# Altium project BTL.PrjPcb
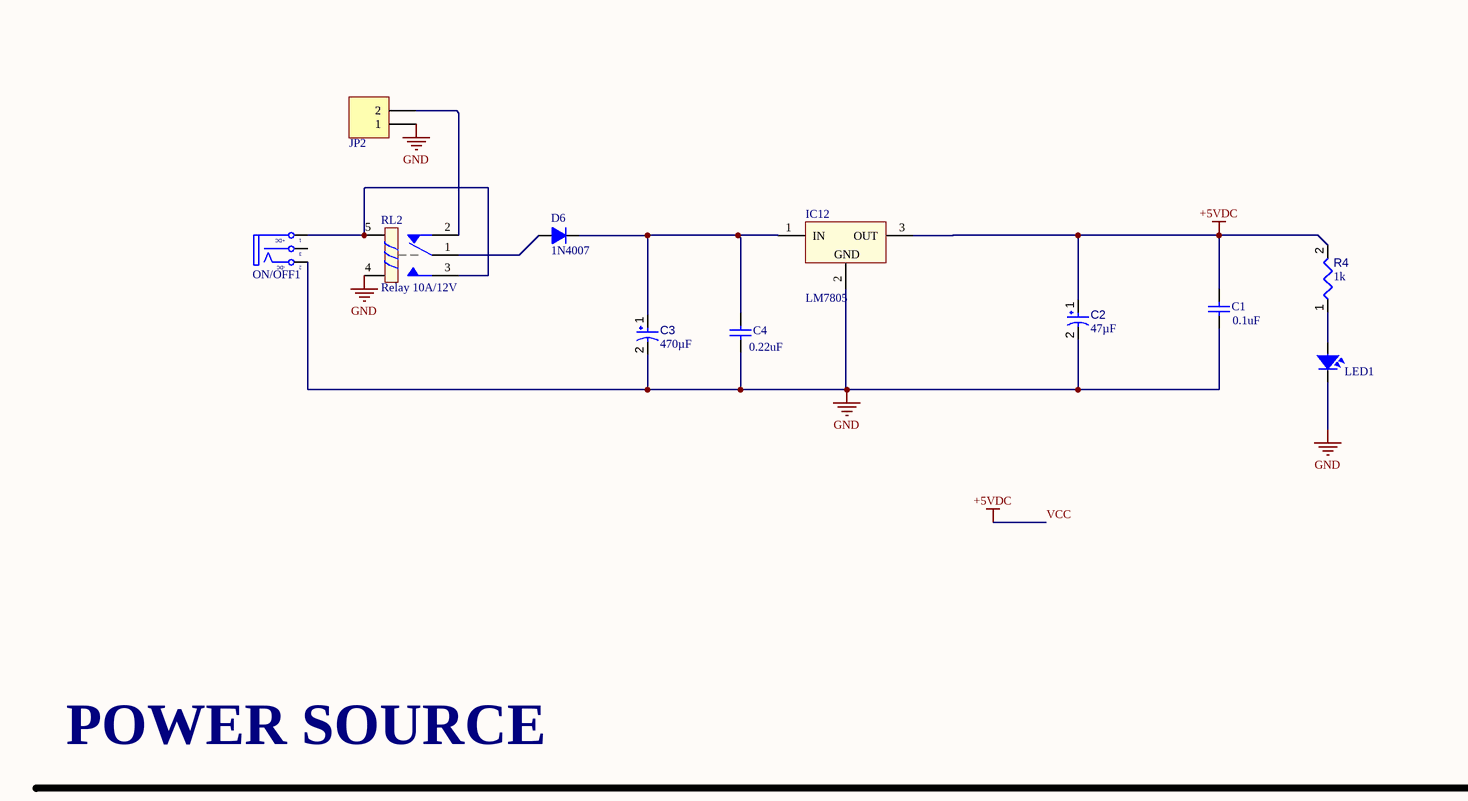
[diagram p0: BTL._SCHESchDoc.SchDoc, top left]
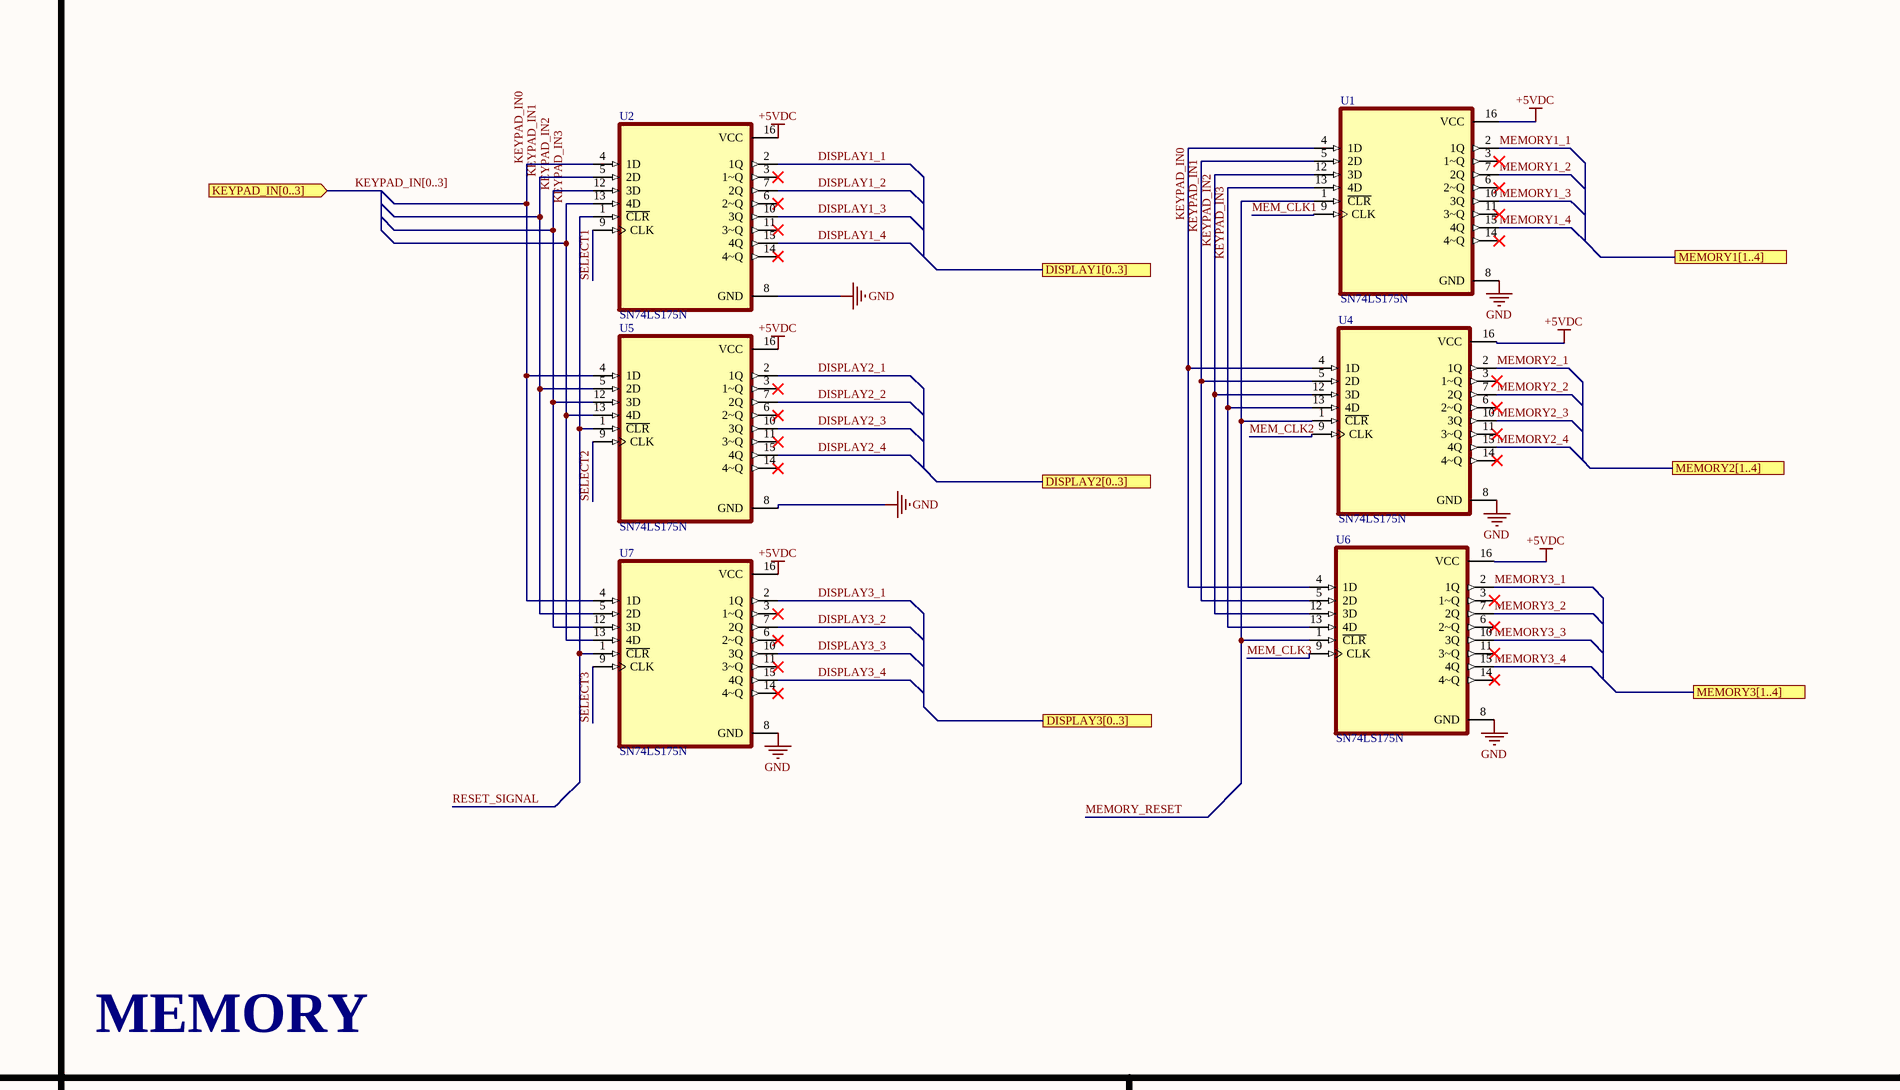
[diagram p1: BTL._SCHESchDoc.SchDoc, top middle]
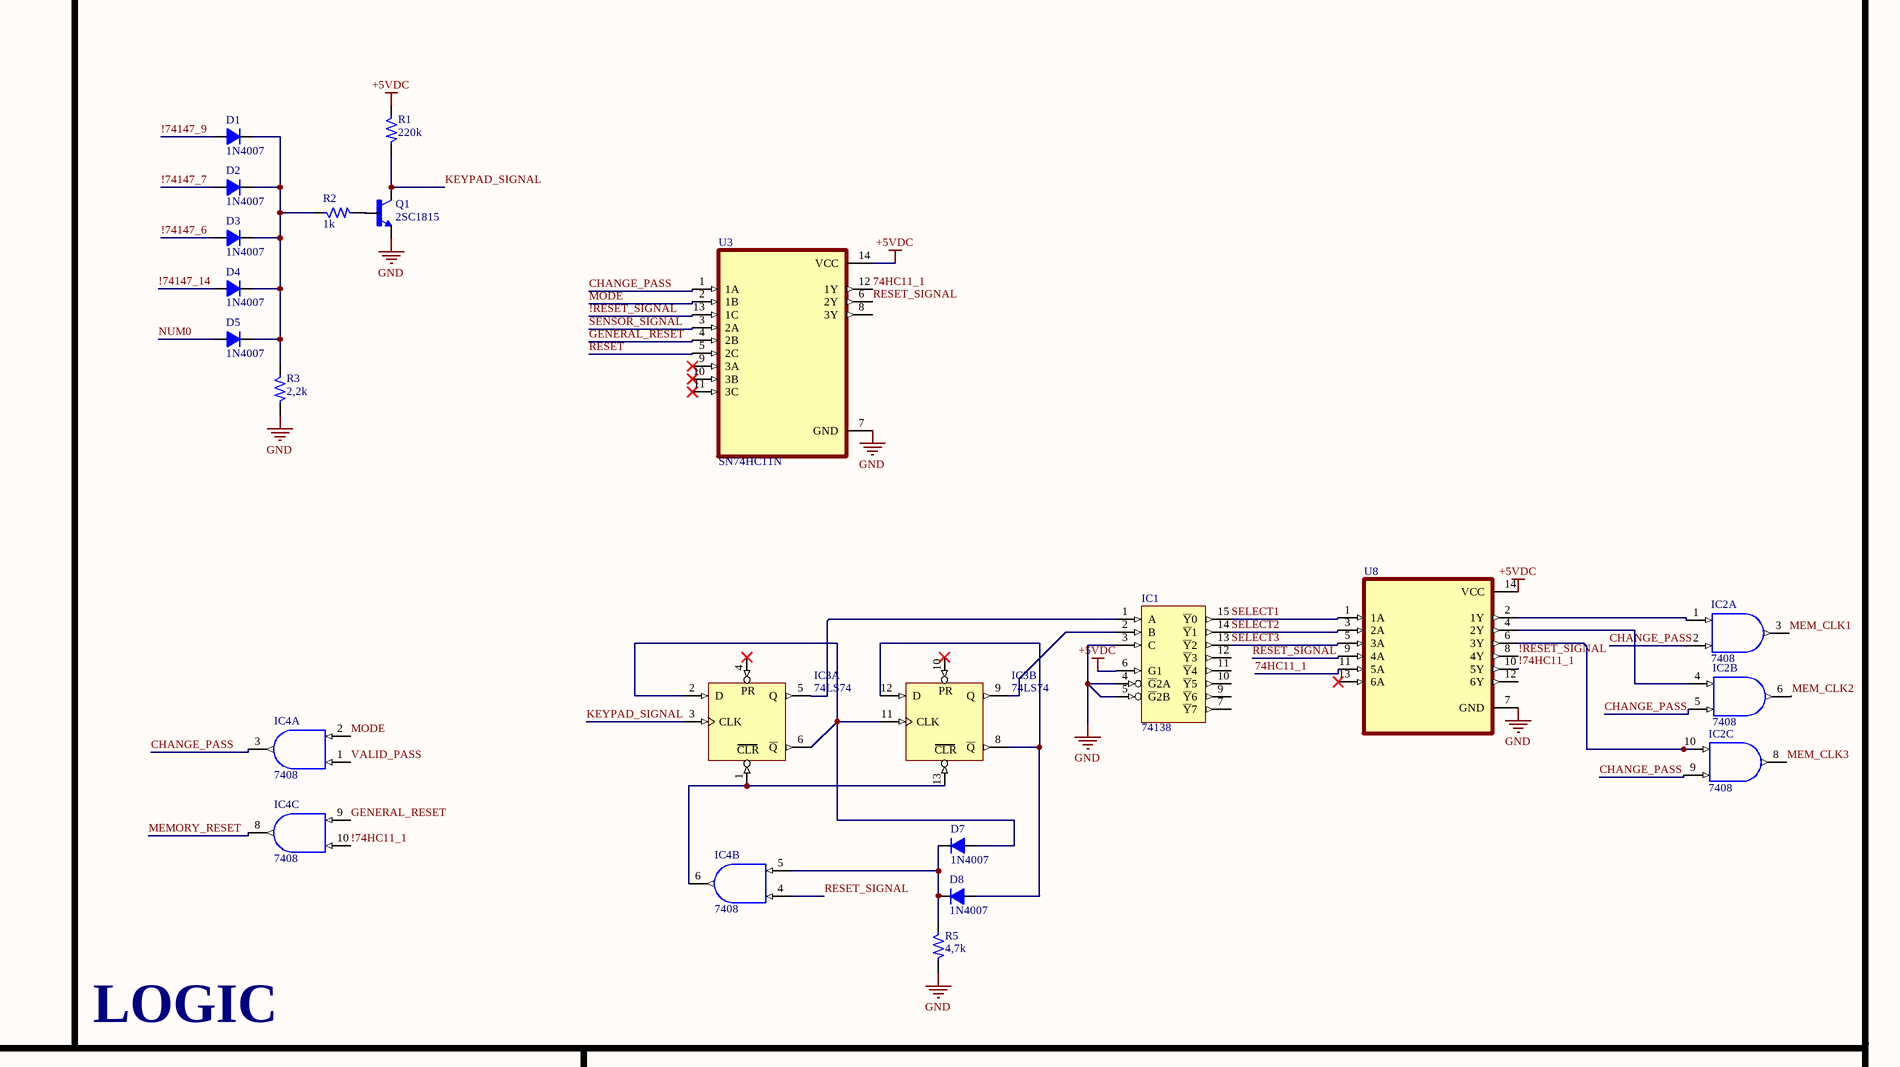
[diagram p2: BTL._SCHESchDoc.SchDoc, top right]
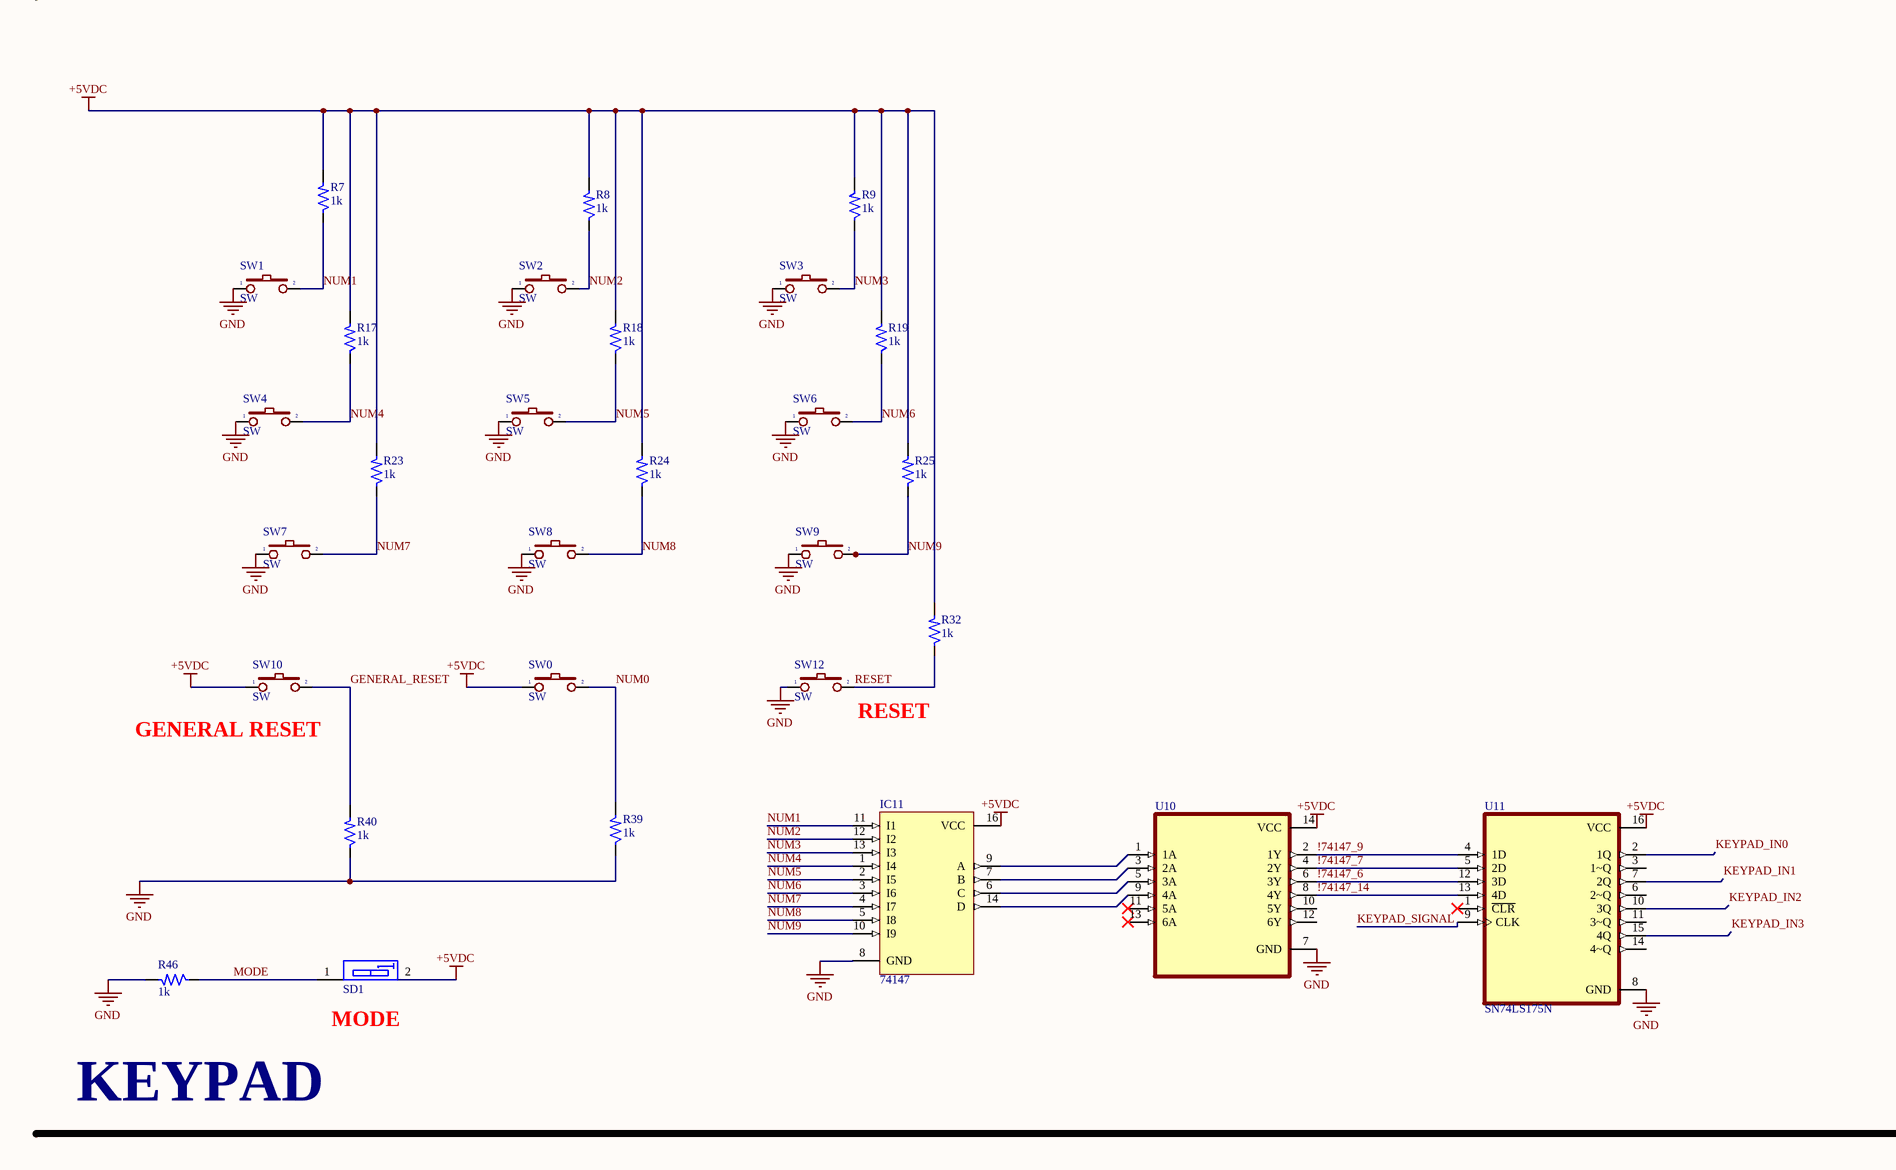
[diagram p3: BTL._SCHESchDoc.SchDoc, bottom left]
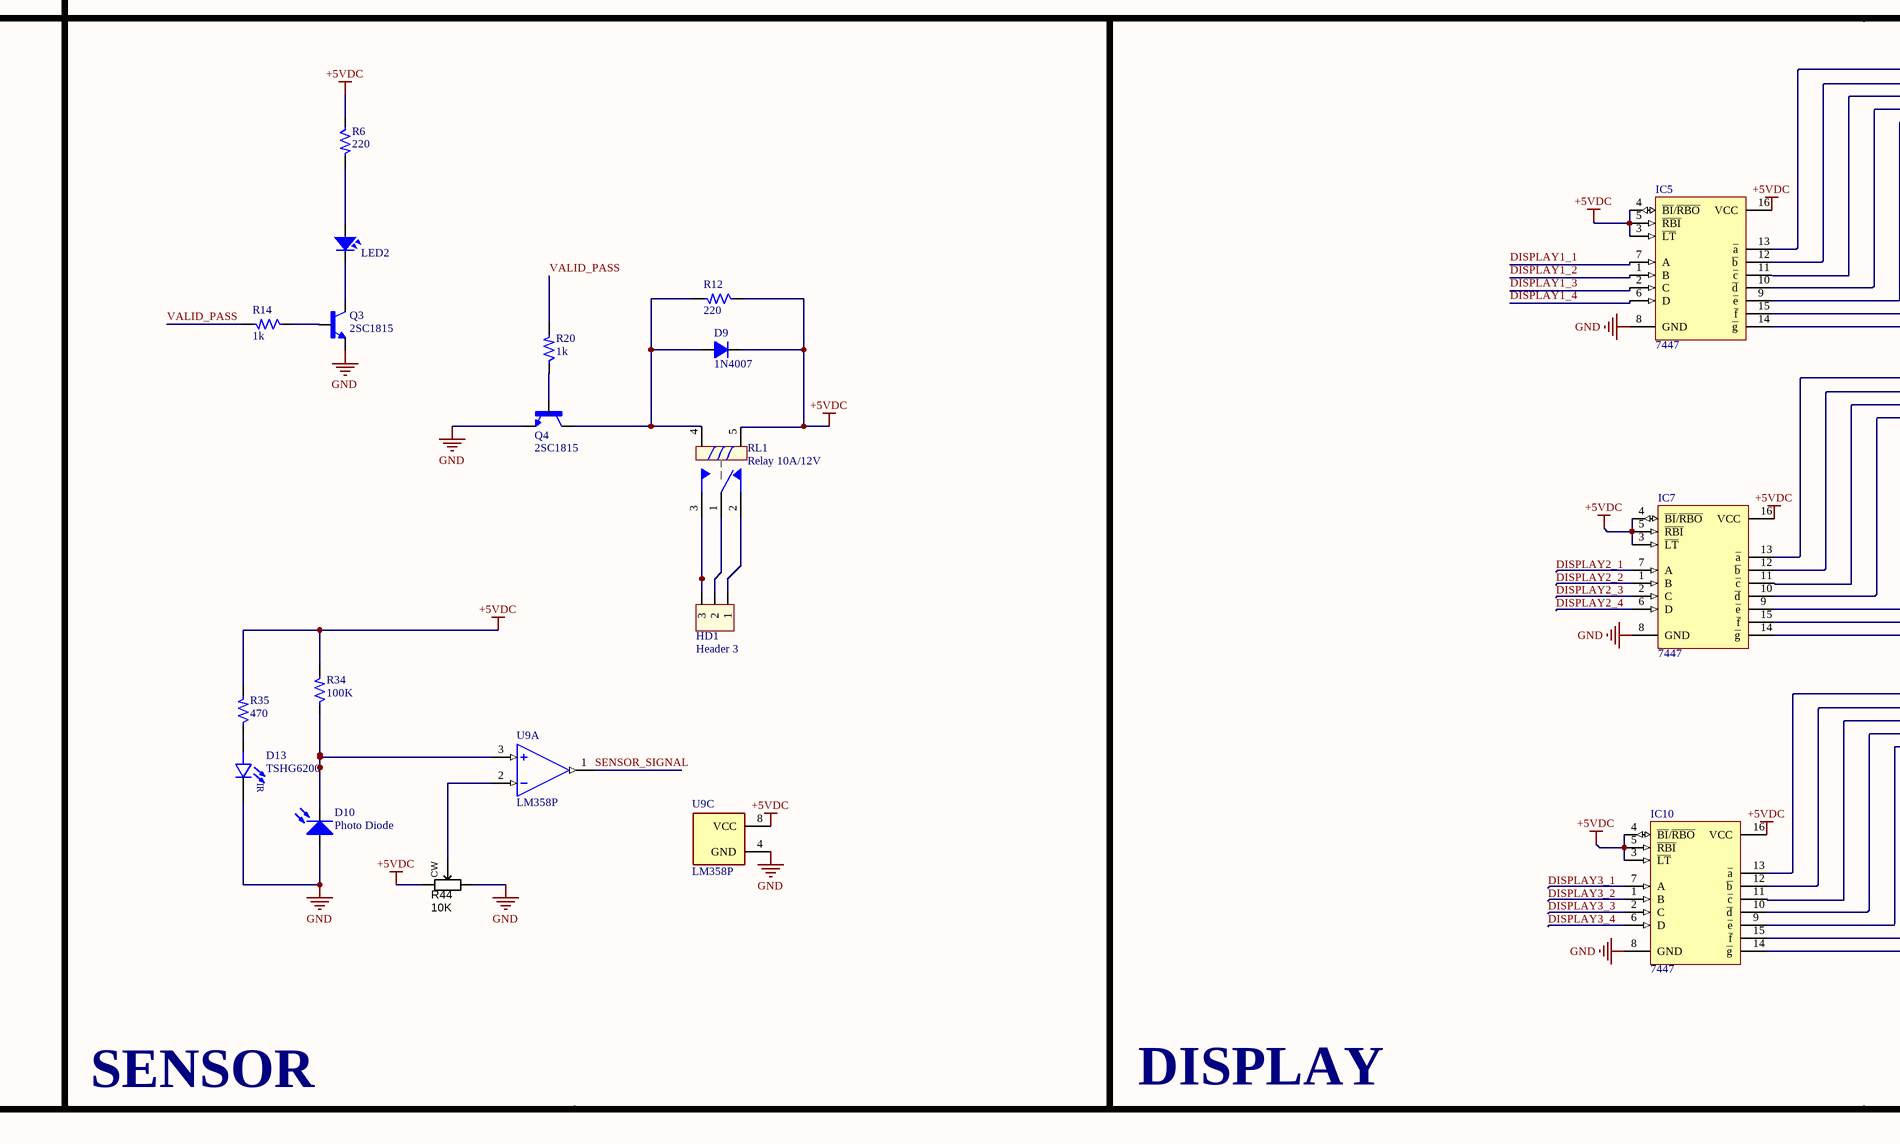
[diagram p4: BTL._SCHESchDoc.SchDoc, bottom middle]
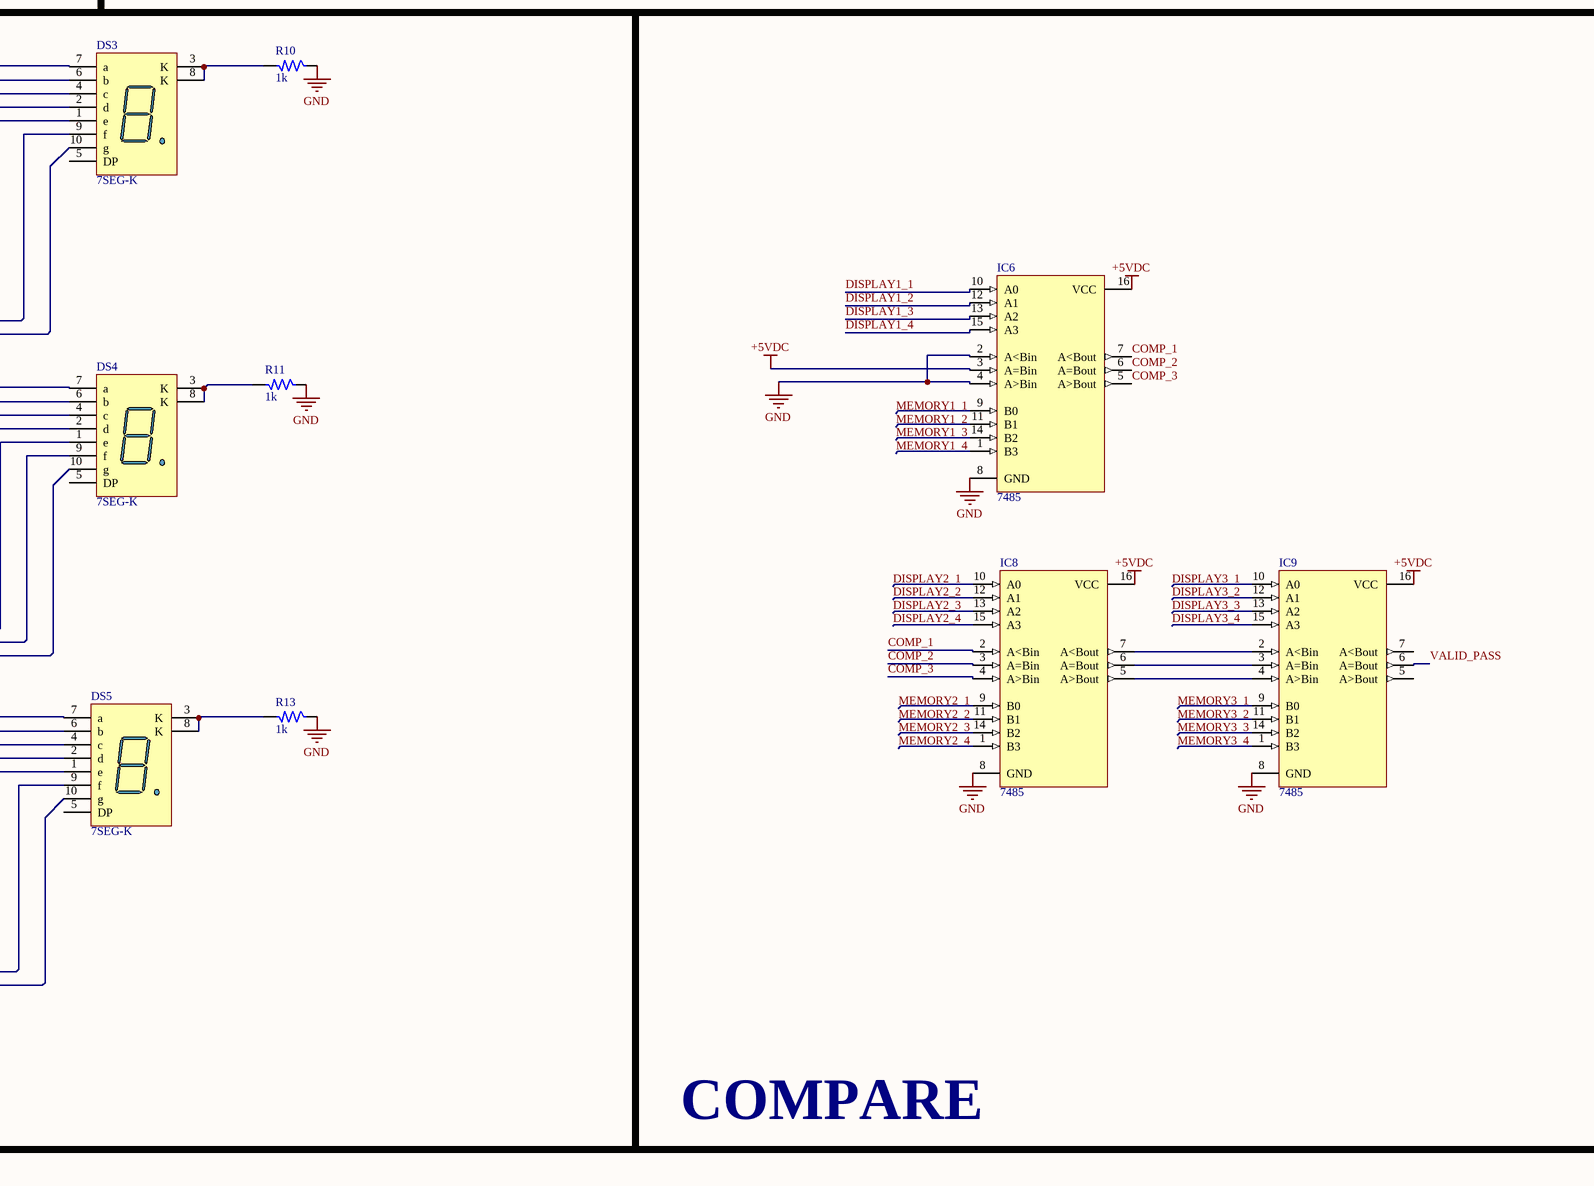
[diagram p5: BTL._SCHESchDoc.SchDoc, bottom right]
1 sheet, 92 parts. Net scope: flat (ports and power ports of the same name join across sheets).
Board file: PCB2.PcbDoc

## Sheet BTL._SCHESchDoc.SchDoc
size A0; SheetNumber: 1; SheetTotal: 1

### Parts
C1  Capacitor Ceramic 2KV  [103/2KV]  (value not drawn)
C2  value 47µF  [CAPPR55-250-1120X630X1220]  (hidden comment: ECA-1HM470)
C3  value 470µF  [CAPPR65-500-2000X1000X2200]  (hidden comment: ECA-1HM471)
C4  Capacitor Ceramic 2KV  [103/2KV]  (value not drawn)
D1  1N4007  [D1A]
D2  1N4007  [D1A]
D3  1N4007  [D1A]
D4  1N4007  [D1A]
D5  1N4007  [D1A]
D6  1N4007  [D1A]
D7  1N4007  [D1A]
D8  1N4007  [D1A]
D9  1N4007  [D1A]
D10  Photo Diode  [LED-5]
D13  TSHG6200  [LEDRD254W55D595H900]
DS3  7SEG-K  [LED7SEG]
DS4  7SEG-K  [LED7SEG]
DS5  7SEG-K  [LED7SEG]
HD1  Header 3  [HED3]
IC1  74138  [DIP16/W0.3]
IC2  7408  [DIP14/W0.3]  (parts A,B,C of 4)
IC3  74LS74  [DIP14/W0.3]  (parts A,B of 2)
IC4  7408  [DIP14/W0.3]  (parts A,B,C of 4)
IC5  7447  [DIP16/W0.3]
IC6  7485  [DIP16/W0.3]
IC7  7447  [DIP16/W0.3]
IC8  7485  [DIP16/W0.3]
IC9  7485  [DIP16/W0.3]
IC10  7447  [DIP16/W0.3]
IC11  74147  [DIP16/W0.3]
IC12  LM7805  [QTO-220]
JP2  Header 2_1  [HED2]  (value not drawn)
LED1  LED  [LED-5-Green]  (value not drawn)
LED2  LED  [LED-5-Green]  (value not drawn)
ON/OFF1  POWER  [DC-IN]  (value not drawn)
Q1  2SC1815  [TO92127P521H534-3]
Q3  2SC1815  [TO92127P521H534-3]
Q4  2SC1815  [TO92127P521H534-3]
R1  220k  [R1/4W3]
R2  1k  [R1/4W3]
R3  2,2k  [R1/4W3]
R4  value 1k  [RESA60-630X240]  (hidden comment: MFR-25FBF52-1K)
R5  4,7k  [R1/4W3]
R6  220  [R1/4W3]
R7  1k  [R1/4W3]
R8  1k  [R1/4W3]
R9  1k  [R1/4W3]
R10  1k  [R1/4W3]
R11  1k  [R1/4W3]
R12  220  [R1/4W3]
R13  1k  [R1/4W3]
R14  1k  [R1/4W3]
R17  1k  [R1/4W3]
R18  1k  [R1/4W3]
R19  1k  [R1/4W3]
R20  1k  [R1/4W3]
R23  1k  [R1/4W3]
R24  1k  [R1/4W3]
R25  1k  [R1/4W3]
R32  1k  [R1/4W3]
R34  100K  [R1/4W3]
R35  470  [R1/4W3]
R39  1k  [R1/4W3]
R40  1k  [R1/4W3]
R44  value 10K  [POT_3306F]  (hidden comment: Single-turn pot)
R46  1k  [R1/4W3]
RL1  Relay 10A/12V  [RL_SPDT_10A]
RL2  Relay 10A/12V  [RL_SPDT_10A]
SD1  SW - DIP2  [DIP2/W0.3K]  (value not drawn)
SW0  SW  [SW2]
SW1  SW  [SW2]
SW2  SW  [SW2]
SW3  SW  [SW2]
SW4  SW  [SW2]
SW5  SW  [SW2]
SW6  SW  [SW2]
SW7  SW  [SW2]
SW8  SW  [SW2]
SW9  SW  [SW2]
SW10  SW  [SW2]
SW12  SW  [SW2]
U1  SN74LS175N  [DIP16]
U2  SN74LS175N  [DIP16]
U3  SN74HC11N  [DIP14/W0.3]
U4  SN74LS175N  [DIP16]
U5  SN74LS175N  [DIP16]
U6  SN74LS175N  [DIP16]
U7  SN74LS175N  [DIP16]
U8  (no value)  [DIP14/W0.3]
U9  LM358P  [DIP8]  (parts A,C of 3)
U10  (no value)  [DIP14/W0.3]
U11  SN74LS175N  [DIP16]

### Ports
DISPLAY1[0..3], DISPLAY2[0..3], DISPLAY3[0..3], KEYPAD_IN[0..3] (in), MEMORY1[1..4], MEMORY2[1..4], MEMORY3[1..4]

### Nets
GND: C1.1 C2.2 C3.2 C4.1 D10.1(A) D13.C IC1.3(C) IC1.4(~{G}2A) IC1.5(~{G}2B) IC1.8(GND) IC2.7(GND) IC3.7(GND) IC4.7(GND) IC5.8(GND) IC6.2(A<Bin) IC6.4(A>Bin) IC6.8(GND) IC7.8(GND) IC8.8(GND) IC9.8(GND) IC10.8(GND) IC11.8(GND) IC12.2(GND) JP2.1 LED1.2 ON/OFF1.2(TN) Q1.1(E) Q3.1(E) Q4.1(E) R3.2 R5.2 R10.1 R11.1 R13.1 R39.1 R40.1 R44.CCW R46.2 RL2.4 SW1.1 SW2.1 SW3.1 SW4.1 SW5.1 SW6.1 SW7.1 SW8.1 SW9.1 SW12.1 U1.8(GND) U2.8(GND) U3.7(GND) U4.8(GND) U5.8(GND) U6.8(GND) U7.8(GND) U8.7(GND) U9.4(GND) U10.7(GND) U11.8(GND)
VCC: C1.2 C2.1 D9.2(K) IC1.6(G1) IC1.16(VCC) IC2.14(VCC) IC3.14(VCC) IC4.14(VCC) IC5.3(~{LT}) IC5.4(~{BI}/~{RBO}) IC5.5(~{RBI}) IC5.16(VCC) IC6.3(A=Bin) IC6.16(VCC) IC7.3(~{LT}) IC7.4(~{BI}/~{RBO}) IC7.5(~{RBI}) IC7.16(VCC) IC8.16(VCC) IC9.16(VCC) IC10.3(~{LT}) IC10.4(~{BI}/~{RBO}) IC10.5(~{RBI}) IC10.16(VCC) IC11.16(VCC) IC12.3(OUT) R1.1 R4.2 R6.1 R7.2 R8.2 R9.2 R12.1 R17.2 R18.2 R19.2 R23.2 R24.2 R25.2 R32.2 R34.2 R35.2 R44.CW RL1.5 SD1.2(A2) SW0.1 SW10.1 U1.16(VCC) U2.16(VCC) U3.14(VCC) U4.16(VCC) U5.16(VCC) U6.16(VCC) U7.16(VCC) U8.14(VCC) U9.8(VCC) U10.14(VCC) U11.16(VCC)  [also labelled +5VDC]
74HC11_1: U3.12(1Y) U8.11(5A)
!74HC11_1: IC4.10(A) U8.10(5Y)
!74147_6: D3.1(A) U10.6(3Y) U11.12(3D)
!74147_7: D2.1(A) U10.4(2Y) U11.5(2D)
!74147_9: D1.1(A) U10.2(1Y) U11.4(1D)
!74147_14: D4.1(A) U10.8(4Y) U11.13(4D)
!RESET_SIGNAL: U3.13(1C) U8.8(4Y)
CHANGE_PASS: IC2.2(B) IC2.5(B) IC2.9(B) IC4.3(O) U3.1(1A)
COMP_1: IC6.7(A<Bout) IC8.2(A<Bin)
COMP_2: IC6.6(A=Bout) IC8.3(A=Bin)
COMP_3: IC6.5(A>Bout) IC8.4(A>Bin)
DISPLAY1_1: IC5.7(A) IC6.10(A0) U2.2(1Q)
DISPLAY1_2: IC5.1(B) IC6.12(A1) U2.7(2Q)
DISPLAY1_3: IC5.2(C) IC6.13(A2) U2.10(3Q)
DISPLAY1_4: IC5.6(D) IC6.15(A3) U2.15(4Q)
DISPLAY2_1: IC7.7(A) IC8.10(A0) U5.2(1Q)
DISPLAY2_2: IC7.1(B) IC8.12(A1) U5.7(2Q)
DISPLAY2_3: IC7.2(C) IC8.13(A2) U5.10(3Q)
DISPLAY2_4: IC7.6(D) IC8.15(A3) U5.15(4Q)
DISPLAY3_1: IC9.10(A0) IC10.7(A) U7.2(1Q)
DISPLAY3_2: IC9.12(A1) IC10.1(B) U7.7(2Q)
DISPLAY3_3: IC9.13(A2) IC10.2(C) U7.10(3Q)
DISPLAY3_4: IC9.15(A3) IC10.6(D) U7.15(4Q)
GENERAL_RESET: IC4.9(B) R40.2 SW10.2 U3.4(2B)
KEYPAD_IN0: U1.4(1D) U2.4(1D) U4.4(1D) U5.4(1D) U6.4(1D) U7.4(1D) U11.2(1Q)
KEYPAD_IN1: U1.5(2D) U2.5(2D) U4.5(2D) U5.5(2D) U6.5(2D) U7.5(2D) U11.7(2Q)
KEYPAD_IN2: U1.12(3D) U2.12(3D) U4.12(3D) U5.12(3D) U6.12(3D) U7.12(3D) U11.10(3Q)
KEYPAD_IN3: U1.13(4D) U2.13(4D) U4.13(4D) U5.13(4D) U6.13(4D) U7.13(4D) U11.15(4Q)
KEYPAD_SIGNAL: IC3.3(CLK) Q1.2(C) R1.2 U11.9(CLK)
MEM_CLK1: IC2.3(O) U1.9(CLK)
MEM_CLK2: IC2.6(O) U4.9(CLK)
MEM_CLK3: IC2.8(O) U6.9(CLK)
MEMORY1_1: IC6.9(B0) U1.2(1Q)
MEMORY1_2: IC6.11(B1) U1.7(2Q)
MEMORY1_3: IC6.14(B2) U1.10(3Q)
MEMORY1_4: IC6.1(B3) U1.15(4Q)
MEMORY2_1: IC8.9(B0) U4.2(1Q)
MEMORY2_2: IC8.11(B1) U4.7(2Q)
MEMORY2_3: IC8.14(B2) U4.10(3Q)
MEMORY2_4: IC8.1(B3) U4.15(4Q)
MEMORY3_1: IC9.9(B0) U6.2(1Q)
MEMORY3_2: IC9.11(B1) U6.7(2Q)
MEMORY3_3: IC9.14(B2) U6.10(3Q)
MEMORY3_4: IC9.1(B3) U6.15(4Q)
MEMORY_RESET: IC4.8(O) U1.1(~{CLR}) U4.1(~{CLR}) U6.1(~{CLR})
MODE: IC4.2(B) R46.1 SD1.1(A1) U3.2(1B)
NUM0: D5.1(A) R39.2 SW0.2
NUM1: IC11.11(I1) R7.1 SW1.2
NUM2: IC11.12(I2) R8.1 SW2.2
NUM3: IC11.13(I3) R9.1 SW3.2
NUM4: IC11.1(I4) R17.1 SW4.2
NUM5: IC11.2(I5) R18.1 SW5.2
NUM6: IC11.3(I6) R19.1 SW6.2
NUM7: IC11.4(I7) R23.1 SW7.2
NUM8: IC11.5(I8) R24.1 SW8.2
NUM9: IC11.10(I9) R25.1 SW9.2
RESET: R32.1 SW12.2 U3.5(2C)
RESET_SIGNAL: IC4.4(A) U2.1(~{CLR}) U3.6(2Y) U5.1(~{CLR}) U7.1(~{CLR}) U8.9(4A)
SELECT1: IC1.15(~{Y}0) U2.9(CLK) U8.1(1A)
SELECT2: IC1.14(~{Y}1) U5.9(CLK) U8.3(2A)
SELECT3: IC1.13(~{Y}2) U7.9(CLK) U8.5(3A)
SENSOR_SIGNAL: U3.3(2A) U9.1(OUT1)
VALID_PASS: IC4.1(A) IC9.6(A=Bout) R14.2 R20.2
NetC3_1: C3.1 C4.2 D6.2(K) IC12.1(IN)
NetD1_2: D1.2(K) D2.2(K) D3.2(K) D4.2(K) D5.2(K) R2.1 R3.1
NetD6_1: D6.1(A) RL2.1
NetD7_1: D7.1(A) IC3.2(D) IC3.6(~{Q}) IC3.11(CLK)
NetD7_2: D7.2(K) D8.2(K) IC4.5(B) R5.1
NetD8_1: D8.1(A) IC3.8(~{Q}) IC3.12(D)
NetD9_1: D9.1(A) Q4.2(C) R12.2 RL1.4
NetD10_2: D10.2(K) R34.1 U9.3(+IN1)
NetD13_A: D13.A R35.1
NetDS3_1: DS3.1(e) IC5.9(~{e})
NetDS3_2: DS3.2(d) IC5.10(~{d})
NetDS3_3: DS3.3(K) DS3.8(K) R10.2
NetDS3_4: DS3.4(c) IC5.11(~{c})
NetDS3_6: DS3.6(b) IC5.12(~{b})
NetDS3_7: DS3.7(a) IC5.13(~{a})
NetDS3_9: DS3.9(f) IC5.15(~{f})
NetDS3_10: DS3.10(g) IC5.14(~{g})
NetDS4_1: DS4.1(e) IC7.9(~{e})
NetDS4_2: DS4.2(d) IC7.10(~{d})
NetDS4_3: DS4.3(K) DS4.8(K) R11.2
NetDS4_4: DS4.4(c) IC7.11(~{c})
NetDS4_6: DS4.6(b) IC7.12(~{b})
NetDS4_7: DS4.7(a) IC7.13(~{a})
NetDS4_9: DS4.9(f) IC7.15(~{f})
NetDS4_10: DS4.10(g) IC7.14(~{g})
NetDS5_1: DS5.1(e) IC10.9(~{e})
NetDS5_2: DS5.2(d) IC10.10(~{d})
NetDS5_3: DS5.3(K) DS5.8(K) R13.2
NetDS5_4: DS5.4(c) IC10.11(~{c})
NetDS5_6: DS5.6(b) IC10.12(~{b})
NetDS5_7: DS5.7(a) IC10.13(~{a})
NetDS5_9: DS5.9(f) IC10.15(~{f})
NetDS5_10: DS5.10(g) IC10.14(~{g})
NetHD1_1: HD1.1 RL1.2
NetHD1_2: HD1.2 RL1.1
NetHD1_3: HD1.3 RL1.3
NetIC1_1: IC1.1(A) IC3.5(Q)
NetIC1_2: IC1.2(B) IC3.9(Q)
NetIC2_1: IC2.1(A) U8.2(1Y)
NetIC2_4: IC2.4(A) U8.4(2Y)
NetIC2_10: IC2.10(A) U8.6(3Y)
NetIC3_1: IC3.1(CLR) IC3.13(CLR) IC4.6(O)
NetIC8_5: IC8.5(A>Bout) IC9.4(A>Bin)
NetIC8_6: IC8.6(A=Bout) IC9.3(A=Bin)
NetIC8_7: IC8.7(A<Bout) IC9.2(A<Bin)
NetIC11_6: IC11.6(C) U10.5(3A)
NetIC11_7: IC11.7(B) U10.3(2A)
NetIC11_9: IC11.9(A) U10.1(1A)
NetIC11_14: IC11.14(D) U10.9(4A)
NetJP2_2: JP2.2 RL2.2
NetLED1_1: LED1.1 R4.1
NetLED2_1: LED2.1 R6.2
NetLED2_2: LED2.2 Q3.2(C)
NetON/OFF1_1: ON/OFF1.1(T) RL2.3 RL2.5
NetQ1_3: Q1.3(B) R2.2
NetQ3_3: Q3.3(B) R14.1
NetQ4_3: Q4.3(B) R20.1
NetR44_W: R44.W U9.2(-IN1)

Not connected (* = marked no-connect by the designer): DS3 5(DP); DS4 5(DP); DS5 5(DP); IC1 7(~{Y}7) 9(~{Y}6) 10(~{Y}5) 11(~{Y}4) 12(~{Y}3); IC3 4(PR)* 10(PR)*; IC9 5(A>Bout) 7(A<Bout); ON/OFF1 3(S); U1 3(1~Q)* 6(2~Q)* 11(3~Q)* 14(4~Q)*; U2 3(1~Q)* 6(2~Q)* 11(3~Q)* 14(4~Q)*; U3 8(3Y) 9(3A)* 10(3B)* 11(3C)*; U4 3(1~Q)* 6(2~Q)* 11(3~Q)* 14(4~Q)*; U5 3(1~Q)* 6(2~Q)* 11(3~Q)* 14(4~Q)*; U6 3(1~Q)* 6(2~Q)* 11(3~Q)* 14(4~Q)*; U7 3(1~Q)* 6(2~Q)* 11(3~Q)* 14(4~Q)*; U8 12(6Y) 13(6A)*; U10 10(5Y) 11(5A)* 12(6Y) 13(6A)*; U11 1(~{CLR})* 3(1~Q) 6(2~Q) 11(3~Q) 14(4~Q)

### Buses and harness runs
bus KEYPAD_IN[0..3] = port KEYPAD_IN[0..3]

### Notes on the sheet
- (near C4) 0.22uF
- (near C1) 0.1uF
- POWER SOURCE
- MEMORY
- LOGIC
- (near SW10) GENERAL RESET
- (near SW12) RESET
- (near SD1) MODE
- KEYPAD
- SENSOR
- DISPLAY
- COMPARE
- (in symbol DCIN) +DC; -DC
- (in symbol TSHG6200) IR

### Library data of the parts
C1 C4 = Cap 2KV: Published: 8-Jun-2000; LatestRevisionDate: 17-Jul-2002; LatestRevisionNote: Re-released for DXP Platform.; PackageReference: RAD-0.3; Publisher: Altium Limited
C2 = CMP-001-00031-7: Aluminum Electrolytic Capacitor, 47 uF, +/-20%, 50 V, -40 to 85 degC, 2-Pin THD, RoHS, Bulk; Manufacturer: Panasonic; Ripple Current: 130mA; Voltage Rating: 50V; Tolerance: 20%; RoHS Compliant: True; Lead Pitch: 2.5mm; Packaging: Bulk; Case/Package: Radial; Diameter: 6.3mm; Datasheet Version: Apr-16; Mounting Technology: TH; Max Operating Temperature: 85°C; Package Quantity: 200; Package Description: 2-Pin Radial Lead, Dia 6.3 mm, Height 12.2 mm; Capacitor Type: Electrolytic; Min Operating Temperature: -40°C; Ripple Current (AC): 130mA; Manufacturer URL: http://www.panasonic.com/; Pins: 2; Datasheet URL: https://industrial.panasonic.com/cdbs/www-data/pdf/RDF0000/DMF0000COL72.pdf; Package Reference: CAPPR55-250-1120X630X1220
C3 = CMP-001-00032-8: Aluminum Electrolytic Capacitor, 470 uF, +/- 20%, 50 V, -40 to 85 degC, 2-Pin THD, RoHS, Bulk; Manufacturer: Panasonic; Ripple Current: 650mA; Voltage Rating: 50V; Ripple Current (AC): 650mA; Packaging: Bulk; Capacitor Type: Electrolytic; Diameter: 10mm; Datasheet URL: http://industrial.panasonic.com/cdbs/www-data/pdf/RDF0000/ABA0000C1047.pdf; Case/Package: Radial; Tolerance: 20%; Max Operating Temperature: 85°C; Pins: 2; Min Operating Temperature: -40°C; RoHS Compliant: True; Mounting Technology: TH; Package Quantity: 200; Lead Pitch: 5mm; Manufacturer URL: http://www.panasonic.com/; Package Description: 2-Pin Radial Lead, Dia 10 mm, Height 22 mm; Datasheet Version: Mar-16; Package Reference: CAPPR65-500-2000X1000X2200
D1-D9 = D1A: Diode 1A; Value: 1N4007
D10 = Photo Diode: Photosensitive Diode
D13 = TSHG6200: 850 nm 100 mA Â±10Â° Through Hole High Speed Infrared Emitting Diode - T-1 3/4 CT; MF: {'manufacturer': u'Vishay'}; Package: None; Price: None; Value: *; MP: TSHG6200; Availability: Unavailable
DS3-DS5 = LED 7SEG-K: 14.2 mm General Purpose Blue 7-Segment Display: CC, RH DP, Gray Surface; MinimumIntensity: 2020 ucd; Note: IF = 10 mA; Published: 8-Jun-2000; LatestRevisionDate: 17-Dec-2003; LatestRevisionNote: Schematic revised, PCB Footprint replaced.; DatasheetDocument: 24-Sep-2002; PackageDocument: 24-Sep-2002; PackageReference: H; Publisher: Altium Limited; Colour: Blue; ComponentLink1Description: Manufacturer Link; ComponentLink1URL: http://www.agilent.com/
HD1 = Hed3: Header 3 (Green); Value: Header 3
IC1 = 74138: 3 -to- 8 Decoder - Out Low; Value: 74138; Copyright by: VanDungEvn@Gmail.com
IC2 IC4 = 7408: Quad 2-Input AND Gate; Value: 7408
IC3 = 7474: Dual D Flip-Flop; Value: 74LS74; Copyright by: VanDungEvn@Gmail.com
IC5 IC7 IC10 = 7447: BCD to 7-Segment Decoder/Driver; Value: 7447 , 74247
IC6 IC8 IC9 = 7485: 4-Bit Magnitude Comparator; Copyright by: VanDungEvn@Gmail.com; Value: 7485
IC11 = 74147: 10-Line to 4-Line Priority Encoder; Copyright by: VanDungEvn@Gmail.com
IC12 = LM78xx: On ap +, from + 5 to + 24VDC; Value: LM7805
JP2 = Header 2_1: Header, 2-Pin; Manufacturer: Generic Components; Class: Connector; Value: Header 2
LED1 LED2 = LED: LED Single colour Green and Red; Value: LED 3 ly Single Colour
ON/OFF1 = DCIN
Q1 Q3 Q4 = 2SC1815: MF: {'manufacturer': u'Micro Commercial'}; Package: None; Price: None; Value: *; MP: 2SC1815; Availability: Unavailable
R1-R3 R5-R14 R17-R20 R23-R25 R32 R34 R35 R39 R40 R46 = Res
R4 = CMP-009-00048-4: Axial Resistor, 1 KOhm, +/- 1%, 250 mW, -55 to 155 degC, 2-Pin THD, RoHS, Bulk; Manufacturer: Yageo; Voltage Rating: 250V; Power: 250mW; Min Operating Temperature: -55°C; Max Operating Temperature: 155°C; Tolerance: 1%; Package Reference: MFR-25; Composition: CarbonFilm; Mounting Technology: TH; Packaging: Bulk; Case/Package: Axial; Datasheet URL: http://www.yageo.com/documents/recent/Yageo%20LR_MFR_2013.pdf; Package Quantity: 200; Manufacturer URL: http://www.yageo.com/; Package Description: 2-Pin Axial Lead, Dia 2.4 mm, Body Length 6.3 mm; Datasheet Version: Apr-13; RoHS Compliant: True
R44 = RES_TRIMMER_10K_1T_THT: Trimmer THD 10K 200mW Single-turn; Manufacturer 1: Bourns Inc.; Manufacturer Part Number 1: 3306F-1-103; Tolerance: ±25%; Ratings: 1/5W; SCDType: spec; Supplier 1: Digi-Key; Supplier Part Number 1: 3306F-103-ND; Material: Cermet; Package / Case: 8.10mm L x 6.81mm W x 7.62mm H
RL1 RL2 = Relay 1: Relay SPDT,10A - 12VDC 5 Pin; Value: Relay SPDT, 10A, 12V
SD1 = SWDIP-1: DIP Switch, 2 Position, SPST; Value: SW - DIP2
SW0-SW10 SW12 = SW2: Switch button 2 pin; Value: SW chip 2 pin
U1 U2 U4-U7 = SN74LS175N: MF: {'manufacturer': u'Texas Instruments'}; Package: None; Price: None; Value: *; MP: SN74LS175N; Availability: Unavailable
U8 U10 = SN74LS04N: 6-ch, 4.75-V to 5.25-V bipolar inverters; MF: Texas Instruments; SnapEDA_Link: https://www.snapeda.com/parts/SN74LS04N/Texas+Instruments/view-part/?ref=snap; Purchase-URL: https://pricing.snapeda.com/search/part/SN74LS04N/?ref=eda; Package: PDIP-14 Texas Instruments; MP: SN74LS04N; Price: None; Availability: In Stock; Check_prices: https://www.snapeda.com/parts/SN74LS04N/Texas+Instruments/view-part/?ref=eda; Value: *
U9 = LM358P: <a href="https://pricing.snapeda.com/parts/LM358P/Texas%20Instruments/view-part?ref=eda">Check prices</a>; MF: {'manufacturer': u'Texas Instruments'}; Package: None; Price: None; Value: *; MP: LM358P; Availability: Unavailable
U11 = SN74LS175N: Quadruple D-Type Flip-Flops With Clear 16-PDIP 0 to 70; MF: Texas Instruments; MP: SN74LS175N; SnapEDA_Link: https://www.snapeda.com/parts/SN74LS175N/Texas%20Instruments/view-part/572262/?ref=snap; Package: PDIP-16 Texas Instruments; Value: *; Check_prices: https://www.snapeda.com/parts/SN74LS175N/Texas%20Instruments/view-part/572262/?ref=eda; Purchase-URL: https://pricing.snapeda.com/search/part/SN74LS175N/?ref=eda; Digi-Key_Part_Number: 296-28719-2-ND
U3 = SN74HC11N: Package: None; Price: None; Value: *; MP: SN74HC11N; Availability: Unavailable